# EAGLE schematic main (EAGLE 9.1.3)

## Sheet 1 of 7
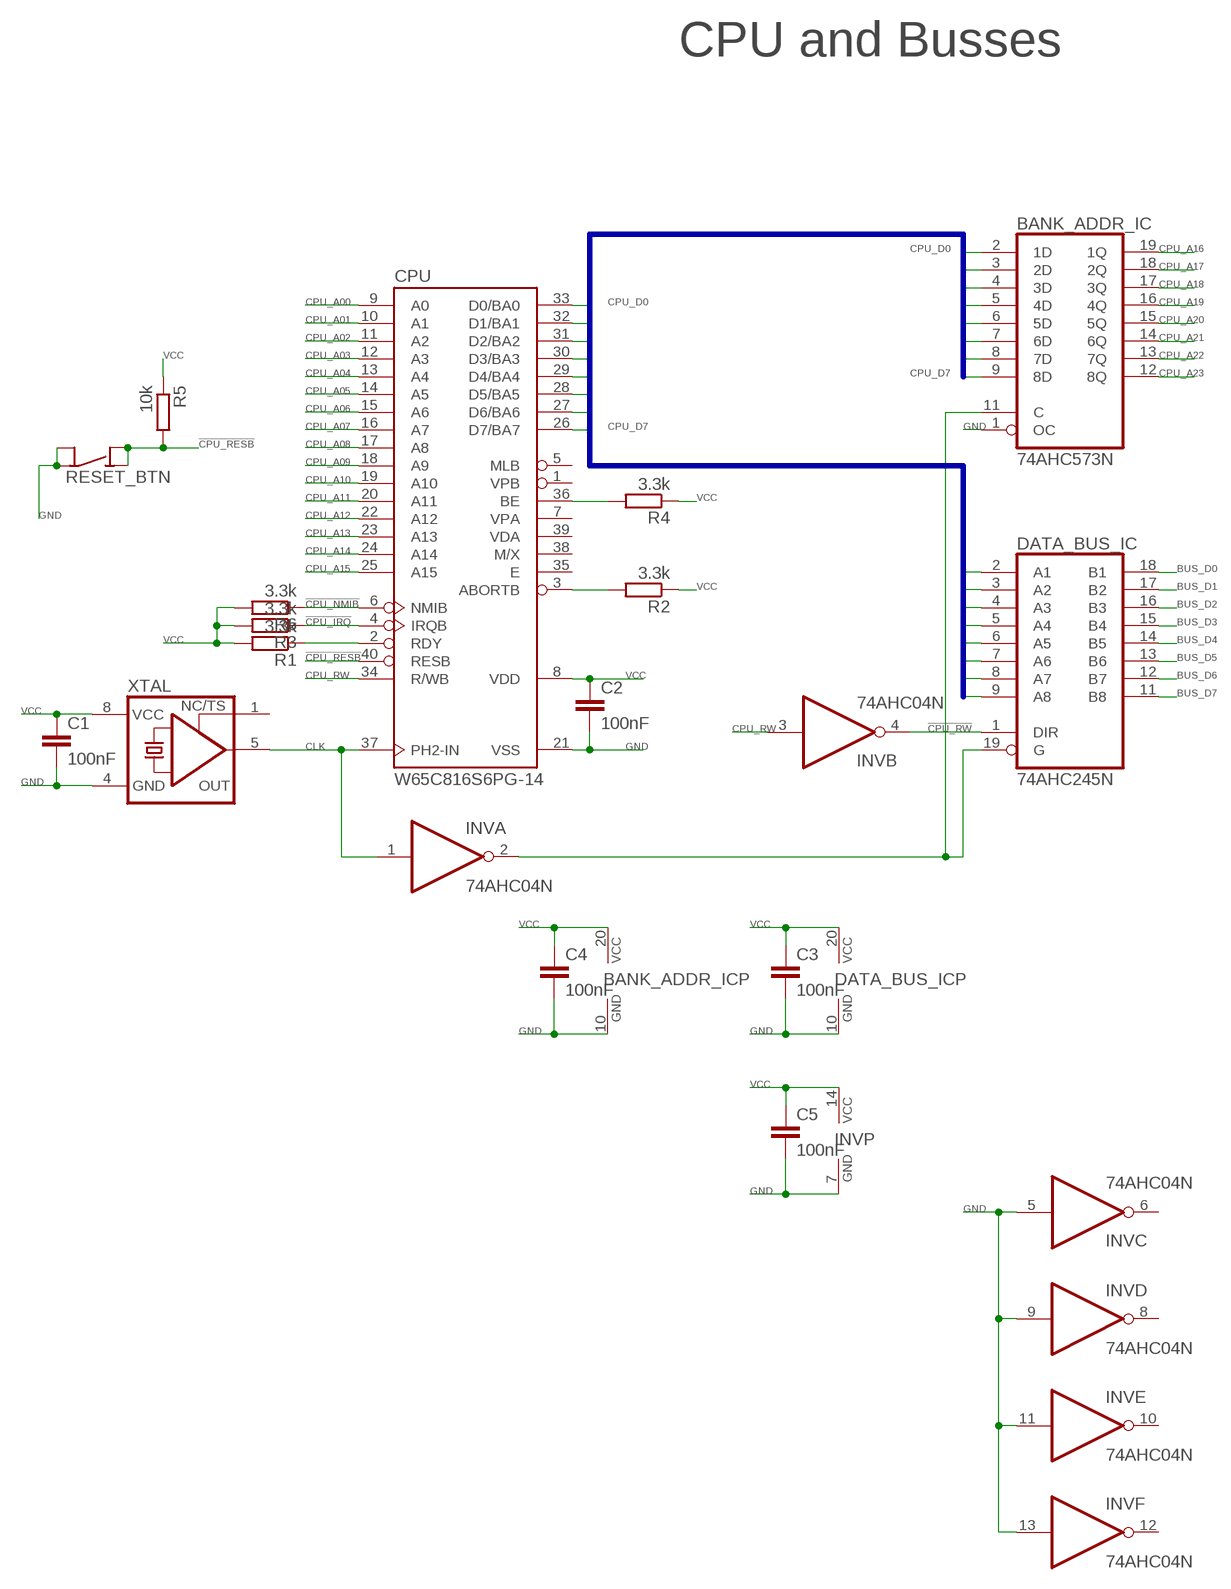
[diagram p0: schematic, sheet 1]

### Parts
BANK_ADDR_IC  74AHC573N  74HC573N  [DIL20]
C1  100nF  C-EU050-024X044  [C050-024X044]
C2  100nF  C-EU050-024X044  [C050-024X044]
C3  100nF  C-EU050-024X044  [C050-024X044]
C4  100nF  C-EU050-024X044  [C050-024X044]
C5  100nF  C-EU050-024X044  [C050-024X044]
CPU  W65C816S6PG-14  W65C816SP  [DIP-40]
DATA_BUS_IC  74AHC245N  74HC245N  [DIL20]
INV  74AHC04N  74HC04N  [DIL14]
R1  3.3k  R-EU_0204/7  [0204/7]
R2  3.3k  R-EU_0204/7  [0204/7]
R3  3.3k  R-EU_0204/7  [0204/7]
R4  3.3k  R-EU_0204/7  [0204/7]
R5  10k  R-EU_0204/7  [0204/7]
R6  3.3k  R-EU_0204/7  [0204/7]
RESET_BTN  SPST4  [6MMTACTILE_4PIN]
XTAL  XO-8  [DIL08S]

### Nets
!CLK: BANK_ADDR_IC.11(C) DATA_BUS_IC.19(G) INV.2(A:O)
!CPU_IRQ: CPU.4(IRQB) R3.1 ; also sheet 5
!CPU_NMIB: CPU.6(NMIB) R6.1 ; also sheet 5
!CPU_RESB: CPU.40(RESB) R5.2 RESET_BTN.A1(NO) RESET_BTN.A2(NO) ; also sheet 6
!CPU_RW: DATA_BUS_IC.1(DIR) INV.4(B:O)
BUS_D0: DATA_BUS_IC.18(B1) ; also sheet 3,4,5,6,7
BUS_D1: DATA_BUS_IC.17(B2) ; also sheet 3,4,5,6,7
BUS_D2: DATA_BUS_IC.16(B3) ; also sheet 3,4,5,6,7
BUS_D3: DATA_BUS_IC.15(B4) ; also sheet 3,4,5,6,7
BUS_D4: DATA_BUS_IC.14(B5) ; also sheet 3,4,5,6,7
BUS_D5: DATA_BUS_IC.13(B6) ; also sheet 3,4,5,6,7
BUS_D6: DATA_BUS_IC.12(B7) ; also sheet 3,4,5,6,7
BUS_D7: DATA_BUS_IC.11(B8) ; also sheet 3,4,5,6,7
CLK: CPU.37(PH2-IN) INV.1(A:I) XTAL.5(OUT) ; also sheet 2,5,6
CPU_A00: CPU.9(A0) ; also sheet 3,4,5,6,7
CPU_A01: CPU.10(A1) ; also sheet 3,4,5,6
CPU_A02: CPU.11(A2) ; also sheet 3,4,5,6
CPU_A03: CPU.12(A3) ; also sheet 3,4,5,6
CPU_A04: CPU.13(A4) ; also sheet 3,4,5
CPU_A05: CPU.14(A5) ; also sheet 3,4,5
CPU_A06: CPU.15(A6) ; also sheet 3,4,5
CPU_A07: CPU.16(A7) ; also sheet 3,4,5
CPU_A08: CPU.17(A8) ; also sheet 3,4,5
CPU_A09: CPU.18(A9) ; also sheet 3,4,5
CPU_A10: CPU.19(A10) ; also sheet 3,4,5
CPU_A11: CPU.20(A11) ; also sheet 3,4,5
CPU_A12: CPU.22(A12) ; also sheet 3,4,5
CPU_A13: CPU.23(A13) ; also sheet 2,4,5
CPU_A14: CPU.24(A14) ; also sheet 2,4,5
CPU_A15: CPU.25(A15) ; also sheet 2,4,5
CPU_A16: BANK_ADDR_IC.19(1Q) ; also sheet 2,4,5
CPU_A17: BANK_ADDR_IC.18(2Q) ; also sheet 2,5
CPU_A18: BANK_ADDR_IC.17(3Q) ; also sheet 2,5
CPU_A19: BANK_ADDR_IC.16(4Q) ; also sheet 5
CPU_A20: BANK_ADDR_IC.15(5Q) ; also sheet 5
CPU_A21: BANK_ADDR_IC.14(6Q) ; also sheet 5
CPU_A22: BANK_ADDR_IC.13(7Q) ; also sheet 5
CPU_A23: BANK_ADDR_IC.12(8Q) ; also sheet 2,5
CPU_D0: BANK_ADDR_IC.2(1D) CPU.33(D0/BA0) DATA_BUS_IC.2(A1)
CPU_D1: BANK_ADDR_IC.3(2D) CPU.32(D1/BA1) DATA_BUS_IC.3(A2)
CPU_D2: BANK_ADDR_IC.4(3D) CPU.31(D2/BA2) DATA_BUS_IC.4(A3)
CPU_D3: BANK_ADDR_IC.5(4D) CPU.30(D3/BA3) DATA_BUS_IC.5(A4)
CPU_D4: BANK_ADDR_IC.6(5D) CPU.29(D4/BA4) DATA_BUS_IC.6(A5)
CPU_D5: BANK_ADDR_IC.7(6D) CPU.28(D5/BA5) DATA_BUS_IC.7(A6)
CPU_D6: BANK_ADDR_IC.8(7D) CPU.27(D6/BA6) DATA_BUS_IC.8(A7)
CPU_D7: BANK_ADDR_IC.9(8D) CPU.26(D7/BA7) DATA_BUS_IC.9(A8)
CPU_RW: CPU.34(R/WB) INV.3(B:I) ; also sheet 4,5,6,7
GND [pwr]: BANK_ADDR_IC.1(OC) BANK_ADDR_IC.10(GND) C1.2 C2.2 C3.2 C4.2 C5.2 CPU.21(VSS) DATA_BUS_IC.10(GND) INV.5(C:I) INV.7(P:GND) INV.9(D:I) INV.11(E:I) INV.13(F:I) RESET_BTN.B1(COM) RESET_BTN.B2(COM) XTAL.4(GND) ; also sheet 2,3,4,5,6,7
N$2: CPU.2(RDY) R1.1
N$3: CPU.3(ABORTB) R2.2
N$5: CPU.36(BE) R4.2
VCC [pwr]: BANK_ADDR_IC.20(VCC) C1.1 C2.1 C3.1 C4.1 C5.1 CPU.8(VDD) DATA_BUS_IC.20(VCC) INV.14(P:VCC) R1.2 R2.1 R3.2 R4.1 R5.1 R6.2 XTAL.8(VCC) ; also sheet 2,3,4,5,6,7
Unconnected: CPU.1(VPB) CPU.5(MLB) CPU.7(VPA) CPU.35(E) CPU.38(M/X) CPU.39(VDA) INV.6(C:O) INV.8(D:O) INV.10(E:O) INV.12(F:O) XTAL.1(TS)

### Buses
CPU_D0,CPU_D1,CPU_D2,CPU_D3,CPU_D4,CPU_D5,CPU_D6,CPU_D7

### Notes on the sheet
- CPU and Busses

## Sheet 2 of 7
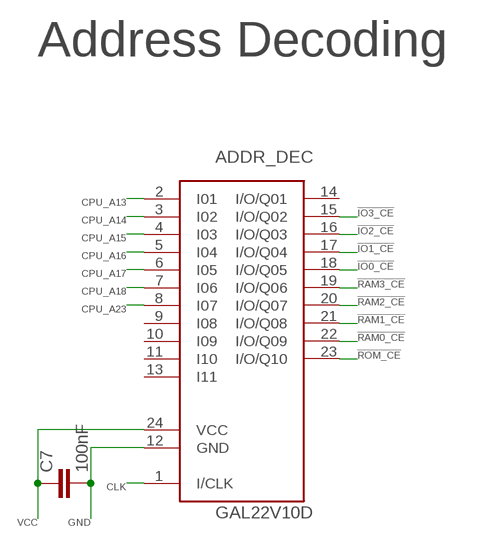
[diagram p1: schematic, sheet 2]

### Parts
ADDR_DEC  GAL22V10D  GAL22V10D-15LPDIP24  [PDIP-T24]
C7  100nF  C-EU050-024X044  [C050-024X044]

### Nets
!IO0_CE: ADDR_DEC.18(I/O/Q05) ; also sheet 5,7
!IO1_CE: ADDR_DEC.17(I/O/Q04) ; also sheet 5,6
!IO2_CE: ADDR_DEC.16(I/O/Q03) ; also sheet 5
!IO3_CE: ADDR_DEC.15(I/O/Q02) ; also sheet 5
!RAM0_CE: ADDR_DEC.22(I/O/Q09) ; also sheet 4
!RAM1_CE: ADDR_DEC.21(I/O/Q08) ; also sheet 4
!RAM2_CE: ADDR_DEC.20(I/O/Q07) ; also sheet 4
!RAM3_CE: ADDR_DEC.19(I/O/Q06) ; also sheet 4
!ROM_CE: ADDR_DEC.23(I/O/Q10) ; also sheet 3
CLK: ADDR_DEC.1(I/CLK) ; also sheet 1,5,6
CPU_A13: ADDR_DEC.2(I01) ; also sheet 1,4,5
CPU_A14: ADDR_DEC.3(I02) ; also sheet 1,4,5
CPU_A15: ADDR_DEC.4(I03) ; also sheet 1,4,5
CPU_A16: ADDR_DEC.5(I04) ; also sheet 1,4,5
CPU_A17: ADDR_DEC.6(I05) ; also sheet 1,5
CPU_A18: ADDR_DEC.7(I06) ; also sheet 1,5
CPU_A23: ADDR_DEC.8(I07) ; also sheet 1,5
GND [pwr]: ADDR_DEC.12(GND) C7.2 ; also sheet 1,3,4,5,6,7
VCC [pwr]: ADDR_DEC.24(VCC) C7.1 ; also sheet 1,3,4,5,6,7
Unconnected: ADDR_DEC.9(I08) ADDR_DEC.10(I09) ADDR_DEC.11(I10) ADDR_DEC.13(I11) ADDR_DEC.14(I/O/Q01)

### Notes on the sheet
- Address Decoding

## Sheet 3 of 7
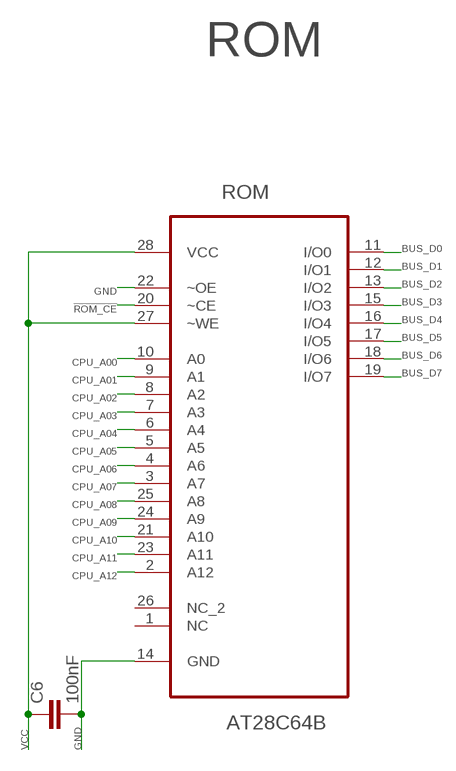
[diagram p2: schematic, sheet 3]

### Parts
C6  100nF  C-EU050-024X044  [C050-024X044]
ROM  AT28C64B  AT28C64B-15PU  [DIP254P1524X482-28]

### Nets
!ROM_CE: ROM.20(~CE) ; also sheet 2
BUS_D0: ROM.11(I/O0) ; also sheet 1,4,5,6,7
BUS_D1: ROM.12(I/O1) ; also sheet 1,4,5,6,7
BUS_D2: ROM.13(I/O2) ; also sheet 1,4,5,6,7
BUS_D3: ROM.15(I/O3) ; also sheet 1,4,5,6,7
BUS_D4: ROM.16(I/O4) ; also sheet 1,4,5,6,7
BUS_D5: ROM.17(I/O5) ; also sheet 1,4,5,6,7
BUS_D6: ROM.18(I/O6) ; also sheet 1,4,5,6,7
BUS_D7: ROM.19(I/O7) ; also sheet 1,4,5,6,7
CPU_A00: ROM.10(A0) ; also sheet 1,4,5,6,7
CPU_A01: ROM.9(A1) ; also sheet 1,4,5,6
CPU_A02: ROM.8(A2) ; also sheet 1,4,5,6
CPU_A03: ROM.7(A3) ; also sheet 1,4,5,6
CPU_A04: ROM.6(A4) ; also sheet 1,4,5
CPU_A05: ROM.5(A5) ; also sheet 1,4,5
CPU_A06: ROM.4(A6) ; also sheet 1,4,5
CPU_A07: ROM.3(A7) ; also sheet 1,4,5
CPU_A08: ROM.25(A8) ; also sheet 1,4,5
CPU_A09: ROM.24(A9) ; also sheet 1,4,5
CPU_A10: ROM.21(A10) ; also sheet 1,4,5
CPU_A11: ROM.23(A11) ; also sheet 1,4,5
CPU_A12: ROM.2(A12) ; also sheet 1,4,5
GND [pwr]: C6.2 ROM.14(GND) ROM.22(~OE) ; also sheet 1,2,4,5,6,7
VCC [pwr]: C6.1 ROM.27(~WE) ROM.28(VCC) ; also sheet 1,2,4,5,6,7
Unconnected: ROM.1(NC) ROM.26(NC_2)

### Notes on the sheet
- ROM

## Sheet 4 of 7
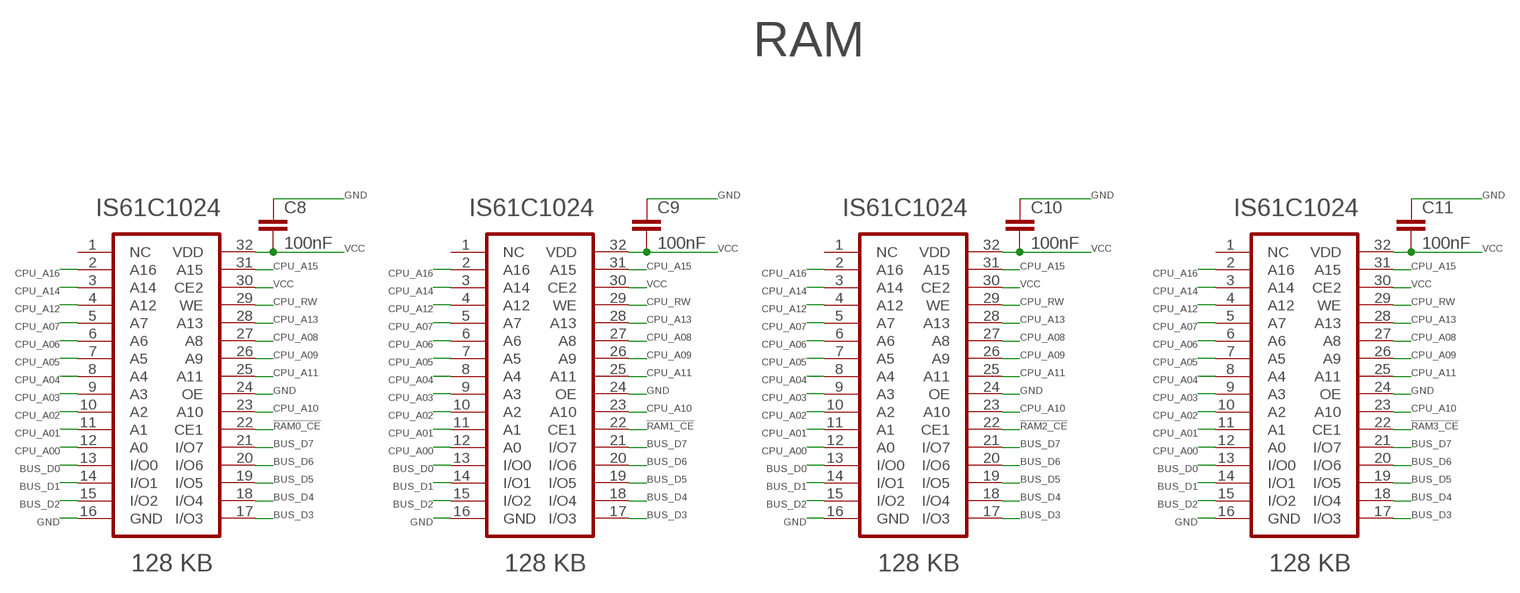
[diagram p3: schematic, sheet 4]

### Parts
C8  100nF  C-EU050-024X044  [C050-024X044]
C9  100nF  C-EU050-024X044  [C050-024X044]
C10  100nF  C-EU050-024X044  [C050-024X044]
C11  100nF  C-EU050-024X044  [C050-024X044]
RAM0  IS61C1024ALDIP32-300  [DIL32-3]
RAM1  IS61C1024ALDIP32-300  [DIL32-3]
RAM2  IS61C1024ALDIP32-300  [DIL32-3]
RAM3  IS61C1024ALDIP32-300  [DIL32-3]

### Nets
!RAM0_CE: RAM0.22(CE1) ; also sheet 2
!RAM1_CE: RAM1.22(CE1) ; also sheet 2
!RAM2_CE: RAM2.22(CE1) ; also sheet 2
!RAM3_CE: RAM3.22(CE1) ; also sheet 2
BUS_D0: RAM0.13(I/O0) RAM1.13(I/O0) RAM2.13(I/O0) RAM3.13(I/O0) ; also sheet 1,3,5,6,7
BUS_D1: RAM0.14(I/O1) RAM1.14(I/O1) RAM2.14(I/O1) RAM3.14(I/O1) ; also sheet 1,3,5,6,7
BUS_D2: RAM0.15(I/O2) RAM1.15(I/O2) RAM2.15(I/O2) RAM3.15(I/O2) ; also sheet 1,3,5,6,7
BUS_D3: RAM0.17(I/O3) RAM1.17(I/O3) RAM2.17(I/O3) RAM3.17(I/O3) ; also sheet 1,3,5,6,7
BUS_D4: RAM0.18(I/O4) RAM1.18(I/O4) RAM2.18(I/O4) RAM3.18(I/O4) ; also sheet 1,3,5,6,7
BUS_D5: RAM0.19(I/O5) RAM1.19(I/O5) RAM2.19(I/O5) RAM3.19(I/O5) ; also sheet 1,3,5,6,7
BUS_D6: RAM0.20(I/O6) RAM1.20(I/O6) RAM2.20(I/O6) RAM3.20(I/O6) ; also sheet 1,3,5,6,7
BUS_D7: RAM0.21(I/O7) RAM1.21(I/O7) RAM2.21(I/O7) RAM3.21(I/O7) ; also sheet 1,3,5,6,7
CPU_A00: RAM0.12(A0) RAM1.12(A0) RAM2.12(A0) RAM3.12(A0) ; also sheet 1,3,5,6,7
CPU_A01: RAM0.11(A1) RAM1.11(A1) RAM2.11(A1) RAM3.11(A1) ; also sheet 1,3,5,6
CPU_A02: RAM0.10(A2) RAM1.10(A2) RAM2.10(A2) RAM3.10(A2) ; also sheet 1,3,5,6
CPU_A03: RAM0.9(A3) RAM1.9(A3) RAM2.9(A3) RAM3.9(A3) ; also sheet 1,3,5,6
CPU_A04: RAM0.8(A4) RAM1.8(A4) RAM2.8(A4) RAM3.8(A4) ; also sheet 1,3,5
CPU_A05: RAM0.7(A5) RAM1.7(A5) RAM2.7(A5) RAM3.7(A5) ; also sheet 1,3,5
CPU_A06: RAM0.6(A6) RAM1.6(A6) RAM2.6(A6) RAM3.6(A6) ; also sheet 1,3,5
CPU_A07: RAM0.5(A7) RAM1.5(A7) RAM2.5(A7) RAM3.5(A7) ; also sheet 1,3,5
CPU_A08: RAM0.27(A8) RAM1.27(A8) RAM2.27(A8) RAM3.27(A8) ; also sheet 1,3,5
CPU_A09: RAM0.26(A9) RAM1.26(A9) RAM2.26(A9) RAM3.26(A9) ; also sheet 1,3,5
CPU_A10: RAM0.23(A10) RAM1.23(A10) RAM2.23(A10) RAM3.23(A10) ; also sheet 1,3,5
CPU_A11: RAM0.25(A11) RAM1.25(A11) RAM2.25(A11) RAM3.25(A11) ; also sheet 1,3,5
CPU_A12: RAM0.4(A12) RAM1.4(A12) RAM2.4(A12) RAM3.4(A12) ; also sheet 1,3,5
CPU_A13: RAM0.28(A13) RAM1.28(A13) RAM2.28(A13) RAM3.28(A13) ; also sheet 1,2,5
CPU_A14: RAM0.3(A14) RAM1.3(A14) RAM2.3(A14) RAM3.3(A14) ; also sheet 1,2,5
CPU_A15: RAM0.31(A15) RAM1.31(A15) RAM2.31(A15) RAM3.31(A15) ; also sheet 1,2,5
CPU_A16: RAM0.2(A16) RAM1.2(A16) RAM2.2(A16) RAM3.2(A16) ; also sheet 1,2,5
CPU_RW: RAM0.29(WE) RAM1.29(WE) RAM2.29(WE) RAM3.29(WE) ; also sheet 1,5,6,7
GND [pwr]: C8.1 C9.1 C10.1 C11.1 RAM0.16(GND) RAM0.24(OE) RAM1.16(GND) RAM1.24(OE) RAM2.16(GND) RAM2.24(OE) RAM3.16(GND) RAM3.24(OE) ; also sheet 1,2,3,5,6,7
VCC [pwr]: C8.2 C9.2 C10.2 C11.2 RAM0.30(CE2) RAM0.32(VDD) RAM1.30(CE2) RAM1.32(VDD) RAM2.30(CE2) RAM2.32(VDD) RAM3.30(CE2) RAM3.32(VDD) ; also sheet 1,2,3,5,6,7
Unconnected: RAM0.1(NC) RAM1.1(NC) RAM2.1(NC) RAM3.1(NC)

### Notes on the sheet
- RAM

## Sheet 5 of 7
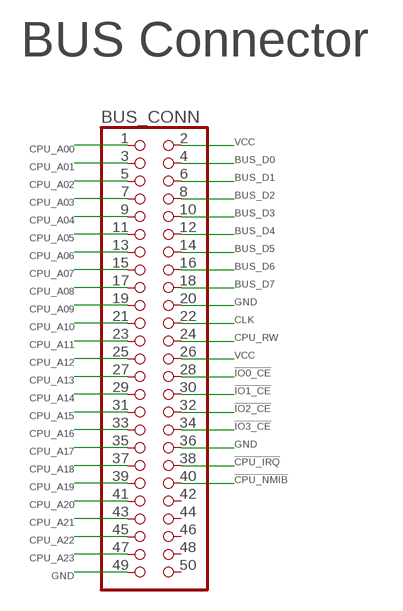
[diagram p4: schematic, sheet 5]

### Parts
BUS_CONN  PINHD-2X25  [2X25]

### Nets
!CPU_IRQ: BUS_CONN.38 ; also sheet 1
!CPU_NMIB: BUS_CONN.40 ; also sheet 1
!IO0_CE: BUS_CONN.28 ; also sheet 2,7
!IO1_CE: BUS_CONN.30 ; also sheet 2,6
!IO2_CE: BUS_CONN.32 ; also sheet 2
!IO3_CE: BUS_CONN.34 ; also sheet 2
BUS_D0: BUS_CONN.4 ; also sheet 1,3,4,6,7
BUS_D1: BUS_CONN.6 ; also sheet 1,3,4,6,7
BUS_D2: BUS_CONN.8 ; also sheet 1,3,4,6,7
BUS_D3: BUS_CONN.10 ; also sheet 1,3,4,6,7
BUS_D4: BUS_CONN.12 ; also sheet 1,3,4,6,7
BUS_D5: BUS_CONN.14 ; also sheet 1,3,4,6,7
BUS_D6: BUS_CONN.16 ; also sheet 1,3,4,6,7
BUS_D7: BUS_CONN.18 ; also sheet 1,3,4,6,7
CLK: BUS_CONN.22 ; also sheet 1,2,6
CPU_A00: BUS_CONN.1 ; also sheet 1,3,4,6,7
CPU_A01: BUS_CONN.3 ; also sheet 1,3,4,6
CPU_A02: BUS_CONN.5 ; also sheet 1,3,4,6
CPU_A03: BUS_CONN.7 ; also sheet 1,3,4,6
CPU_A04: BUS_CONN.9 ; also sheet 1,3,4
CPU_A05: BUS_CONN.11 ; also sheet 1,3,4
CPU_A06: BUS_CONN.13 ; also sheet 1,3,4
CPU_A07: BUS_CONN.15 ; also sheet 1,3,4
CPU_A08: BUS_CONN.17 ; also sheet 1,3,4
CPU_A09: BUS_CONN.19 ; also sheet 1,3,4
CPU_A10: BUS_CONN.21 ; also sheet 1,3,4
CPU_A11: BUS_CONN.23 ; also sheet 1,3,4
CPU_A12: BUS_CONN.25 ; also sheet 1,3,4
CPU_A13: BUS_CONN.27 ; also sheet 1,2,4
CPU_A14: BUS_CONN.29 ; also sheet 1,2,4
CPU_A15: BUS_CONN.31 ; also sheet 1,2,4
CPU_A16: BUS_CONN.33 ; also sheet 1,2,4
CPU_A17: BUS_CONN.35 ; also sheet 1,2
CPU_A18: BUS_CONN.37 ; also sheet 1,2
CPU_A19: BUS_CONN.39 ; also sheet 1
CPU_A20: BUS_CONN.41 ; also sheet 1
CPU_A21: BUS_CONN.43 ; also sheet 1
CPU_A22: BUS_CONN.45 ; also sheet 1
CPU_A23: BUS_CONN.47 ; also sheet 1,2
CPU_RW: BUS_CONN.24 ; also sheet 1,4,6,7
GND [pwr]: BUS_CONN.20 BUS_CONN.36 BUS_CONN.49 ; also sheet 1,2,3,4,6,7
VCC [pwr]: BUS_CONN.2 BUS_CONN.26 ; also sheet 1,2,3,4,6,7
Unconnected: BUS_CONN.42 BUS_CONN.44 BUS_CONN.46 BUS_CONN.48 BUS_CONN.50

### Notes on the sheet
- BUS Connector

## Sheet 6 of 7
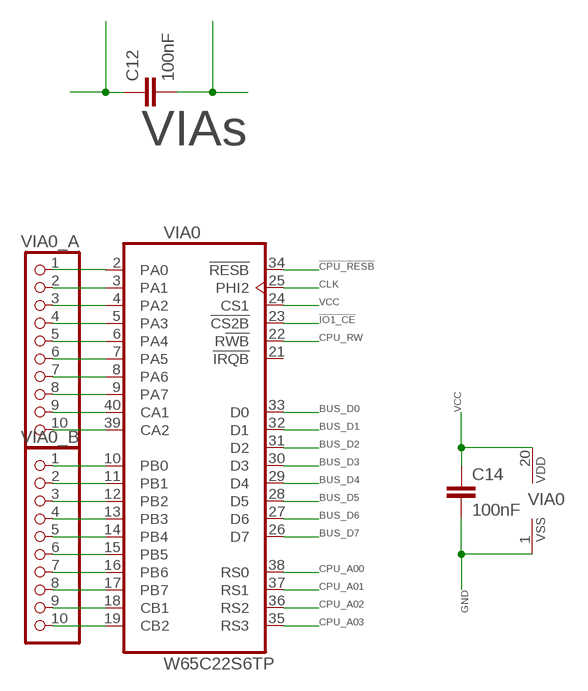
[diagram p5: schematic, sheet 6]

### Parts
C12  100nF  C-EU050-024X044  [C050-024X044]
C14  100nF  C-EU050-024X044  [C050-024X044]
VIA0  W65C22S6TP  [DIL40]
VIA0_A  PINHD-1X10  [1X10]
VIA0_B  PINHD-1X10  [1X10]

### Nets
!CPU_RESB: VIA0.34(VIA:!RESB) ; also sheet 1
!IO1_CE: VIA0.23(VIA:!CS2B) ; also sheet 2,5
BUS_D0: VIA0.33(VIA:D0) ; also sheet 1,3,4,5,7
BUS_D1: VIA0.32(VIA:D1) ; also sheet 1,3,4,5,7
BUS_D2: VIA0.31(VIA:D2) ; also sheet 1,3,4,5,7
BUS_D3: VIA0.30(VIA:D3) ; also sheet 1,3,4,5,7
BUS_D4: VIA0.29(VIA:D4) ; also sheet 1,3,4,5,7
BUS_D5: VIA0.28(VIA:D5) ; also sheet 1,3,4,5,7
BUS_D6: VIA0.27(VIA:D6) ; also sheet 1,3,4,5,7
BUS_D7: VIA0.26(VIA:D7) ; also sheet 1,3,4,5,7
CLK: VIA0.25(VIA:PHI2) ; also sheet 1,2,5
CPU_A00: VIA0.38(VIA:RS0) ; also sheet 1,3,4,5,7
CPU_A01: VIA0.37(VIA:RS1) ; also sheet 1,3,4,5
CPU_A02: VIA0.36(VIA:RS2) ; also sheet 1,3,4,5
CPU_A03: VIA0.35(VIA:RS3) ; also sheet 1,3,4,5
CPU_RW: VIA0.22(VIA:R!WB) ; also sheet 1,4,5,7
GND [pwr]: C14.2 VIA0.1(VIAP:VSS) ; also sheet 1,2,3,4,5,7
GND1 [pwr]: C12.2
N$1: VIA0.2(VIA:PA0) VIA0_A.1
N$4: VIA0.3(VIA:PA1) VIA0_A.2
N$6: VIA0.4(VIA:PA2) VIA0_A.3
N$7: VIA0.5(VIA:PA3) VIA0_A.4
N$8: VIA0.6(VIA:PA4) VIA0_A.5
N$9: VIA0.7(VIA:PA5) VIA0_A.6
N$10: VIA0.8(VIA:PA6) VIA0_A.7
N$11: VIA0.9(VIA:PA7) VIA0_A.8
N$12: VIA0.40(VIA:CA1) VIA0_A.9
N$13: VIA0.39(VIA:CA2) VIA0_A.10
N$14: VIA0.10(VIA:PB0) VIA0_B.1
N$15: VIA0.11(VIA:PB1) VIA0_B.2
N$16: VIA0.12(VIA:PB2) VIA0_B.3
N$17: VIA0.13(VIA:PB3) VIA0_B.4
N$18: VIA0.14(VIA:PB4) VIA0_B.5
N$19: VIA0.15(VIA:PB5) VIA0_B.6
N$20: VIA0.16(VIA:PB6) VIA0_B.7
N$21: VIA0.17(VIA:PB7) VIA0_B.8
N$22: VIA0.18(VIA:CB1) VIA0_B.9
N$23: VIA0.19(VIA:CB2) VIA0_B.10
VCC [pwr]: C14.1 VIA0.20(VIAP:VDD) VIA0.24(VIA:CS1) ; also sheet 1,2,3,4,5,7
VCC1 [pwr]: C12.1
Unconnected: VIA0.21(VIA:!IRQB)

### Notes on the sheet
- VIAs

## Sheet 7 of 7
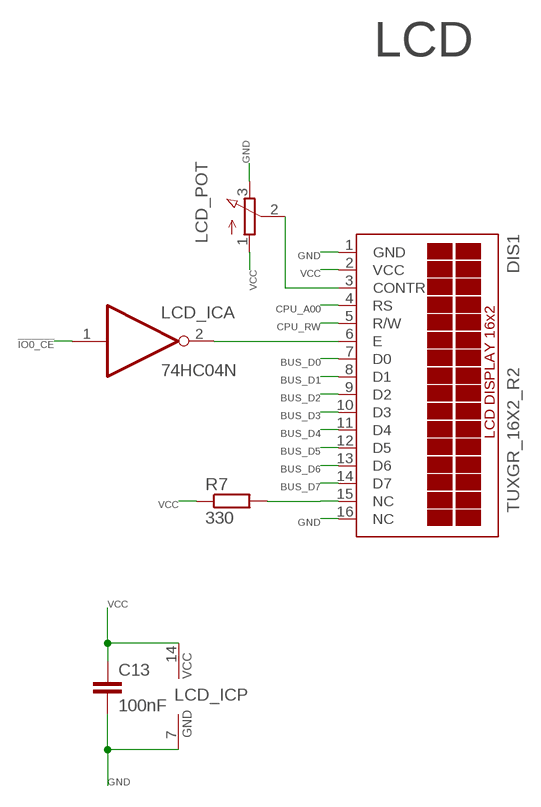
[diagram p6: schematic, sheet 7]

### Parts
C13  100nF  C-EU050-024X044  [C050-024X044]
DIS1  TUXGR_16X2_R2  [TUXGR_16X2_R2]
LCD_IC  74HC04N  [DIL14]
LCD_POT  3RP/1610N  [3RP/1610N]
R7  330  R-EU_0204/7  [0204/7]

### Nets
!IO0_CE: LCD_IC.1(A:I) ; also sheet 2,5
BUS_D0: DIS1.7(D0) ; also sheet 1,3,4,5,6
BUS_D1: DIS1.8(D1) ; also sheet 1,3,4,5,6
BUS_D2: DIS1.9(D2) ; also sheet 1,3,4,5,6
BUS_D3: DIS1.10(D3) ; also sheet 1,3,4,5,6
BUS_D4: DIS1.11(D4) ; also sheet 1,3,4,5,6
BUS_D5: DIS1.12(D5) ; also sheet 1,3,4,5,6
BUS_D6: DIS1.13(D6) ; also sheet 1,3,4,5,6
BUS_D7: DIS1.14(D7) ; also sheet 1,3,4,5,6
CPU_A00: DIS1.4(RS) ; also sheet 1,3,4,5,6
CPU_RW: DIS1.5(R/W) ; also sheet 1,4,5,6
GND [pwr]: C13.2 DIS1.1(GND) DIS1.16(NC) LCD_IC.7(P:GND) LCD_POT.3(E) ; also sheet 1,2,3,4,5,6
N$24: DIS1.3(CONTR) LCD_POT.2(S)
N$25: DIS1.6(E) LCD_IC.2(A:O)
N$34: DIS1.15(NC) R7.2
VCC [pwr]: C13.1 DIS1.2(VCC) LCD_IC.14(P:VCC) LCD_POT.1(A) R7.1 ; also sheet 1,2,3,4,5,6
Unconnected: LCD_IC.3(B:I) LCD_IC.4(B:O) LCD_IC.5(C:I) LCD_IC.6(C:O) LCD_IC.8(D:O) LCD_IC.9(D:I) LCD_IC.10(E:O) LCD_IC.11(E:I) LCD_IC.12(F:O) LCD_IC.13(F:I)

### Notes on the sheet
- LCD

## Library data of the parts
ADDR_DEC = my:GAL22V10D-15LP
BANK_ADDR_IC = 74xx-eu:74*573: 8-bit D latch BUS DRIVER
BUS_CONN = pinhead:PINHD-2X25: PIN HEADER
C1-C7 C12-C14 = rcl:C-EU: CAPACITOR, European symbol; SPICEPREFIX: C
C8-C11 = resistor:C-EU: CAPACITOR, European symbol
CPU = 65xxx:W65C816SP: Wetern Digital Version
DATA_BUS_IC = 74xx-eu:74*245: Octal BUS TRANSCEIVER, 3-state
DIS1 = display-lcd:TUXGR_16X2_R2: Tuxgraphics LCD display 16x2 characters reflective, without background light Source: tuxgr_12x2_r2.pdf; OC_FARNELL: unknown; OC_NEWARK: unknown
INV LCD_IC = 74xx-eu:74*04: Hex INVERTER
LCD_POT = pot:3RP/1610N: 16mm Potentiometer one level Source: http://www.alphapotentiometers.net/html/16mm_pot_2.html
R1-R6 = resistor:R-EU_: RESISTOR, European symbol
R7 = rcl:R-EU_: RESISTOR, European symbol; SPICEPREFIX: R
RAM0 RAM1-RAM3 = is61c1024al:IS61C1024AL
RESET_BTN = bt_electromech:SPST4: SPST switch with 2 pins per contact
ROM = Atmel_By_element14_Batch_1-00:AT28C64B-15PU: Parallel EEPROM; DESCRIPTION: Parallel EEPROM; MPN: AT28C64B-15PU; OC_FARNELL: 1095784; OC_NEWARK: 96K6557; PACKAGE: PCDIP-28; SUPPLIER: ATMEL
VIA0 = 6502:W65C22S: W65C22 by WDC
VIA0_A VIA0_B = pinhead:PINHD-1X10: PIN HEADER
XTAL = crystal:XO-: CRYSTAL; OC_FARNELL: unknown; OC_NEWARK: unknown

## Net classes
0 default: width 0.152 mm
1 pwr: width 0.305 mm